# Altium schematic sheet stm32070.SchDoc
size A2
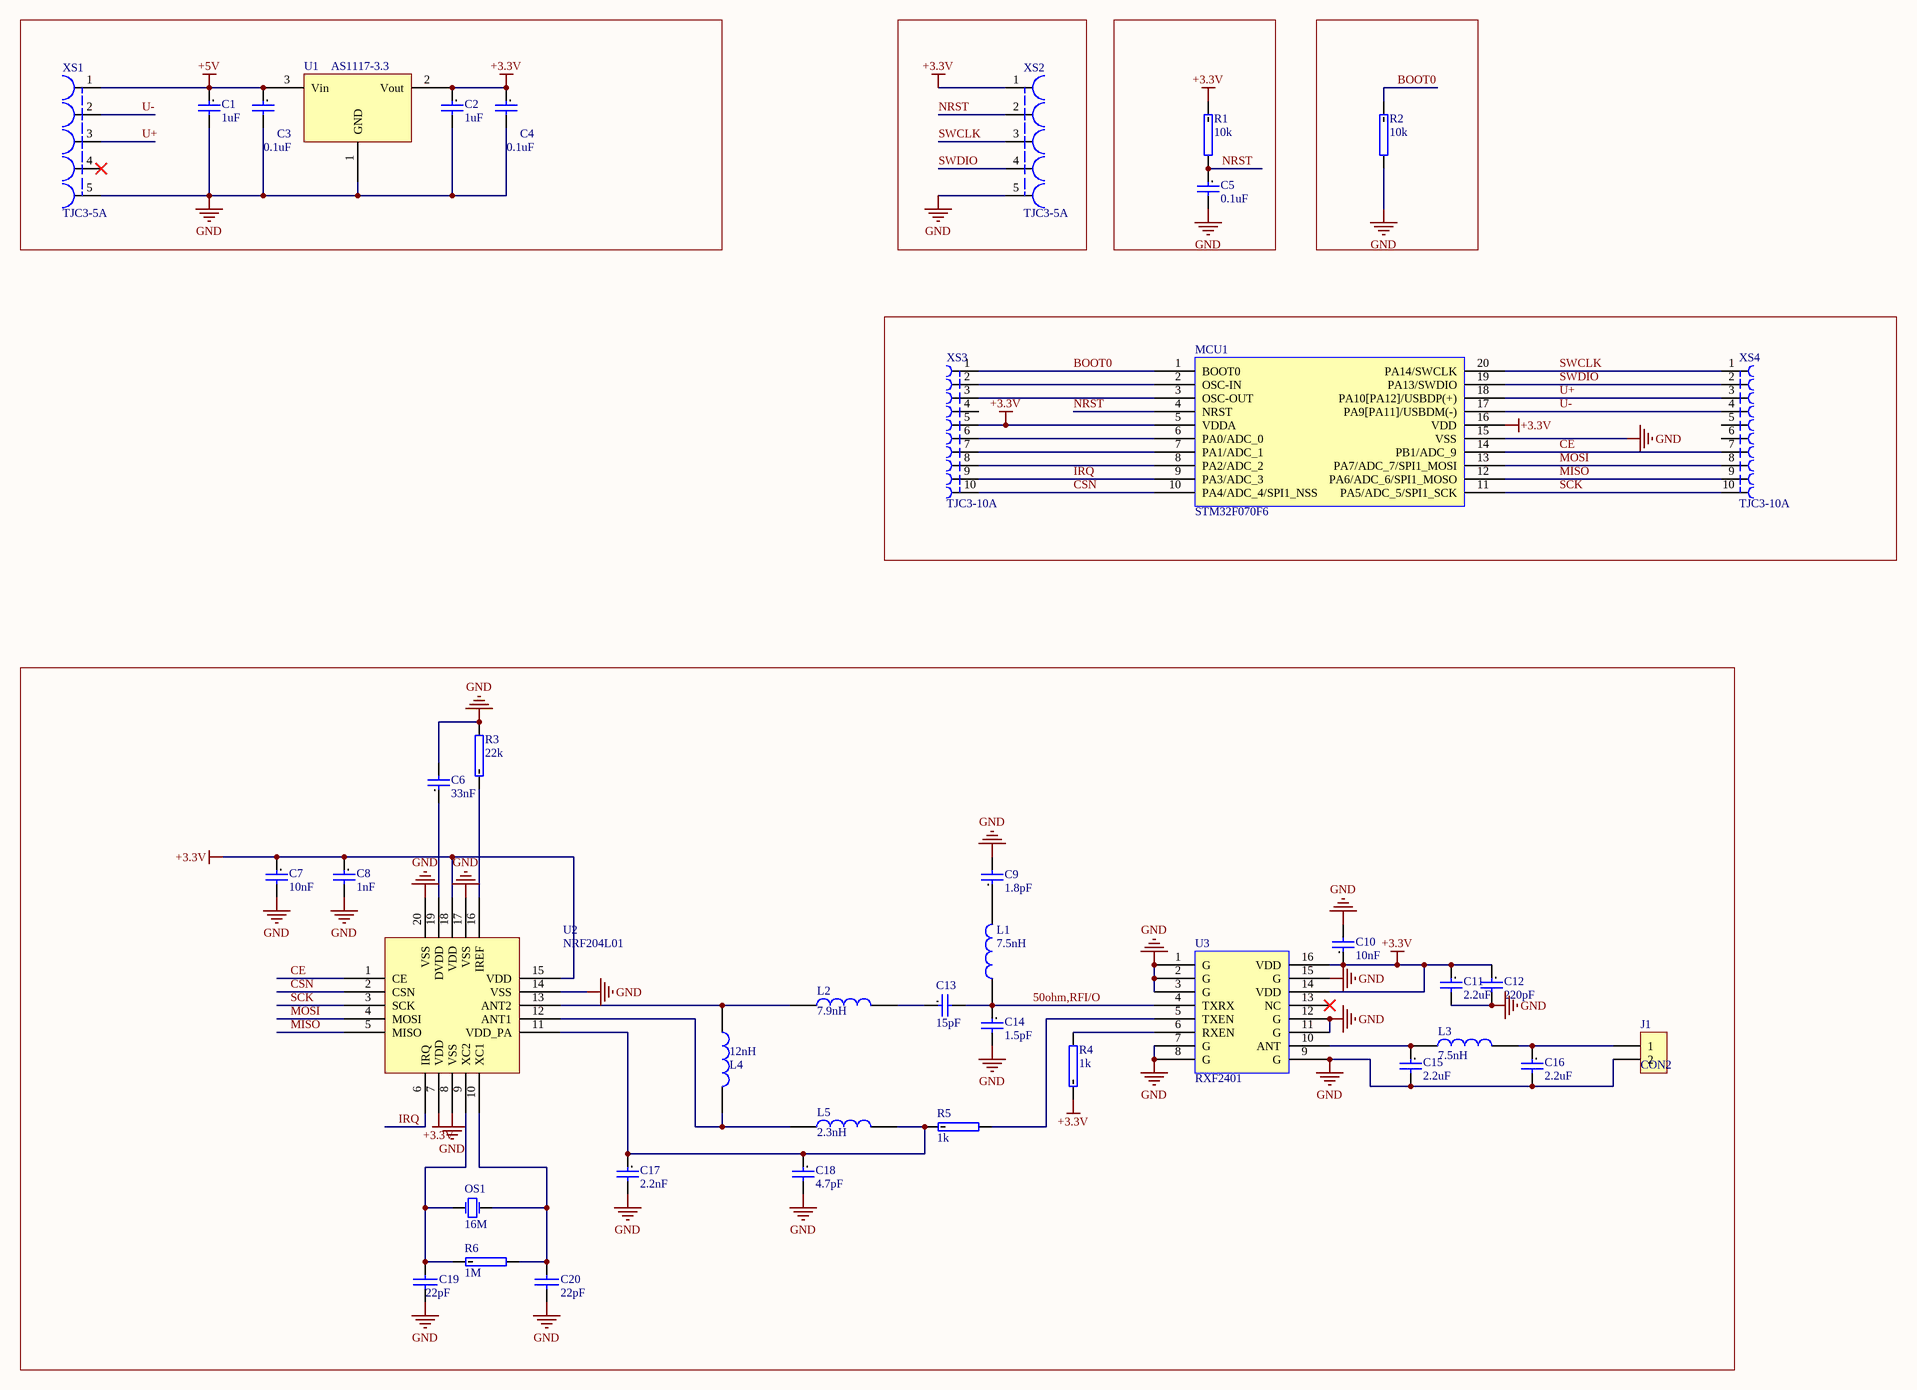
[diagram p0: stm32070.SchDoc]

## Parts
C1  1uF  [0603C]
C2  1uF  [0603C]
C3  0.1uF  [0603C]
C4  0.1uF  [0603C]
C5  0.1uF  [0603C]
C6  33nF  [0603C]
C7  10nF  [0603C]
C8  1nF  [0603C]
C9  1.8pF  [0603C]
C10  10nF  [0603C]
C11  2.2uF  [0603C]
C12  220pF  [0603C]
C13  15pF  [0603C]
C14  1.5pF  [0603C]
C15  2.2uF  [0603C]
C16  2.2uF  [0603C]
C17  2.2nF  [0603C]
C18  4.7pF  [0603C]
C19  22pF  [0603C]
C20  22pF  [0603C]
J1  CON2  [同轴连接器]
L1  7.5nH  [0603R]
L2  7.9nH  [0603R]
L3  7.5nH  [0603R]
L4  12nH  [0603R]
L5  2.3nH  [0603R]
MCU1  STM32F070F6  [TSSOP20]
OS1  16M  [晶振-5032-4P]
R1  10k  [0603R]
R2  10k  [0603R]
R3  22k  [0603R]
R4  1k  [0603R]
R5  1k  [0603R]
R6  1M  [0603R]
U1  AS1117-3.3  [SOT-89]
U2  NRF204L01  [QFN20]
U3  RXF2401  [QFN16]
XS1  TJC3-5A  [MicorUSB 手机插座]
XS2  TJC3-5A  [SIP-5]
XS3  TJC3-10A  [SIP-10]
XS4  TJC3-10A  [SIP-10]

## Nets
+3.3V: C2.1 C4.1 C7.1 C8.1 C10.1 C11.1 C12.1 MCU1.5(VDDA) MCU1.16(VDD) R1.1 R4.1 U1.2(Vout) U2.7(VDD) U2.15(VDD) U2.18(VDD) U3.14(VDD) U3.16(VDD) XS2.1 XS3.5
+5V: C1.1 C3.1 U1.3(Vin) XS1.1
GND: C1.2 C2.2 C3.2 C4.2 C5.2 C6.2 C7.2 C8.2 C9.2 C10.2 C11.2 C12.2 C14.2 C15.2 C16.2 C17.2 C18.2 C19.2 C20.2 J1.2 MCU1.15(VSS) R2.2 R3.2 U1.1(GND) U2.8(VSS) U2.14(VSS) U2.17(VSS) U2.20(VSS) U3.1(G) U3.2(G) U3.3(G) U3.7(G) U3.8(G) U3.9(G) U3.11(G) U3.12(G) U3.15(G) XS1.5 XS2.5
50ohm,RFI/O: C13.2 C14.1 L1.1 U3.4(TXRX)
BOOT0: MCU1.1(BOOT0) R2.1 XS3.1
CE: MCU1.14(PB1/ADC_9) U2.1(CE) XS4.7
CSN: MCU1.10(PA4/ADC_4/SPI1_NSS) U2.2(CSN) XS3.10
IRQ: MCU1.9(PA3/ADC_3) U2.6(IRQ) XS3.9
MISO: MCU1.12(PA6/ADC_6/SPI1_MOSO) U2.5(MISO) XS4.9
MOSI: MCU1.13(PA7/ADC_7/SPI1_MOSI) U2.4(MOSI) XS4.8
NRST: C5.1 MCU1.4(NRST) R1.2 XS2.2
SCK: MCU1.11(PA5/ADC_5/SPI1_SCK) U2.3(SCK) XS4.10
SWCLK: MCU1.20(PA14/SWCLK) XS2.3 XS4.1
SWDIO: MCU1.19(PA13/SWDIO) XS2.4 XS4.2
U+: MCU1.18(PA10[PA12]/USBDP(+)) XS1.3 XS4.3
U-: MCU1.17(PA9[PA11]/USBDM(-)) XS1.2 XS4.4
NetC6_1: C6.1 U2.19(DVDD)
NetC9_1: C9.1 L1.2
NetC13_1: C13.1 L2.2
NetC15_1: C15.1 L3.1 U3.10(ANT)
NetC16_1: C16.1 J1.1 L3.2
NetC17_1: C17.1 C18.1 L5.2 R5.1 U2.11(VDD_PA)
NetC19_1: C19.1 OS1.1(OSC1) R6.1 U2.9(XC2)
NetC20_1: C20.1 OS1.2(OSC2) R6.2 U2.10(XC1)
NetL2_1: L2.1 L4.1 U2.13(ANT2)
NetL4_2: L4.2 L5.1 U2.12(ANT1)
NetMCU1_2: MCU1.2(OSC-IN) XS3.2
NetMCU1_3: MCU1.3(OSC-OUT) XS3.3
NetMCU1_6: MCU1.6(PA0/ADC_0) XS3.6
NetMCU1_7: MCU1.7(PA1/ADC_1) XS3.7
NetMCU1_8: MCU1.8(PA2/ADC_2) XS3.8
NetR3_1: R3.1 U2.16(IREF)
NetR4_2: R4.2 U3.6(RXEN)
NetR5_2: R5.2 U3.5(TXEN)

Not connected (* = marked no-connect by the designer): U3 13(NC)*; XS1 4*; XS3 4; XS4 5 6

## Library data of the parts
C1-C18 = CAP
C19 C20 = CAP: Capacitor
J1 = CON2: Connector
L1-L5 = INDUCTOR
OS1 = XTAL
R1-R6 = RSE1
U3 = RXF2401C